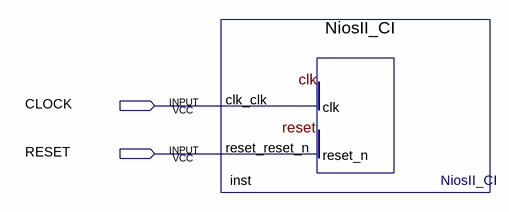
[diagram p0: schematic sheet]
// Quartus schematic TOP.bdf as structural Verilog: 1 symbols, 2 pins
module TOP (
  input  CLOCK,
  input  RESET
);

  NiosII_CI inst (.clk_clk(CLOCK), .reset_reset_n(RESET));
endmodule
